# EAGLE design relay-board (EAGLE 7.5.0)
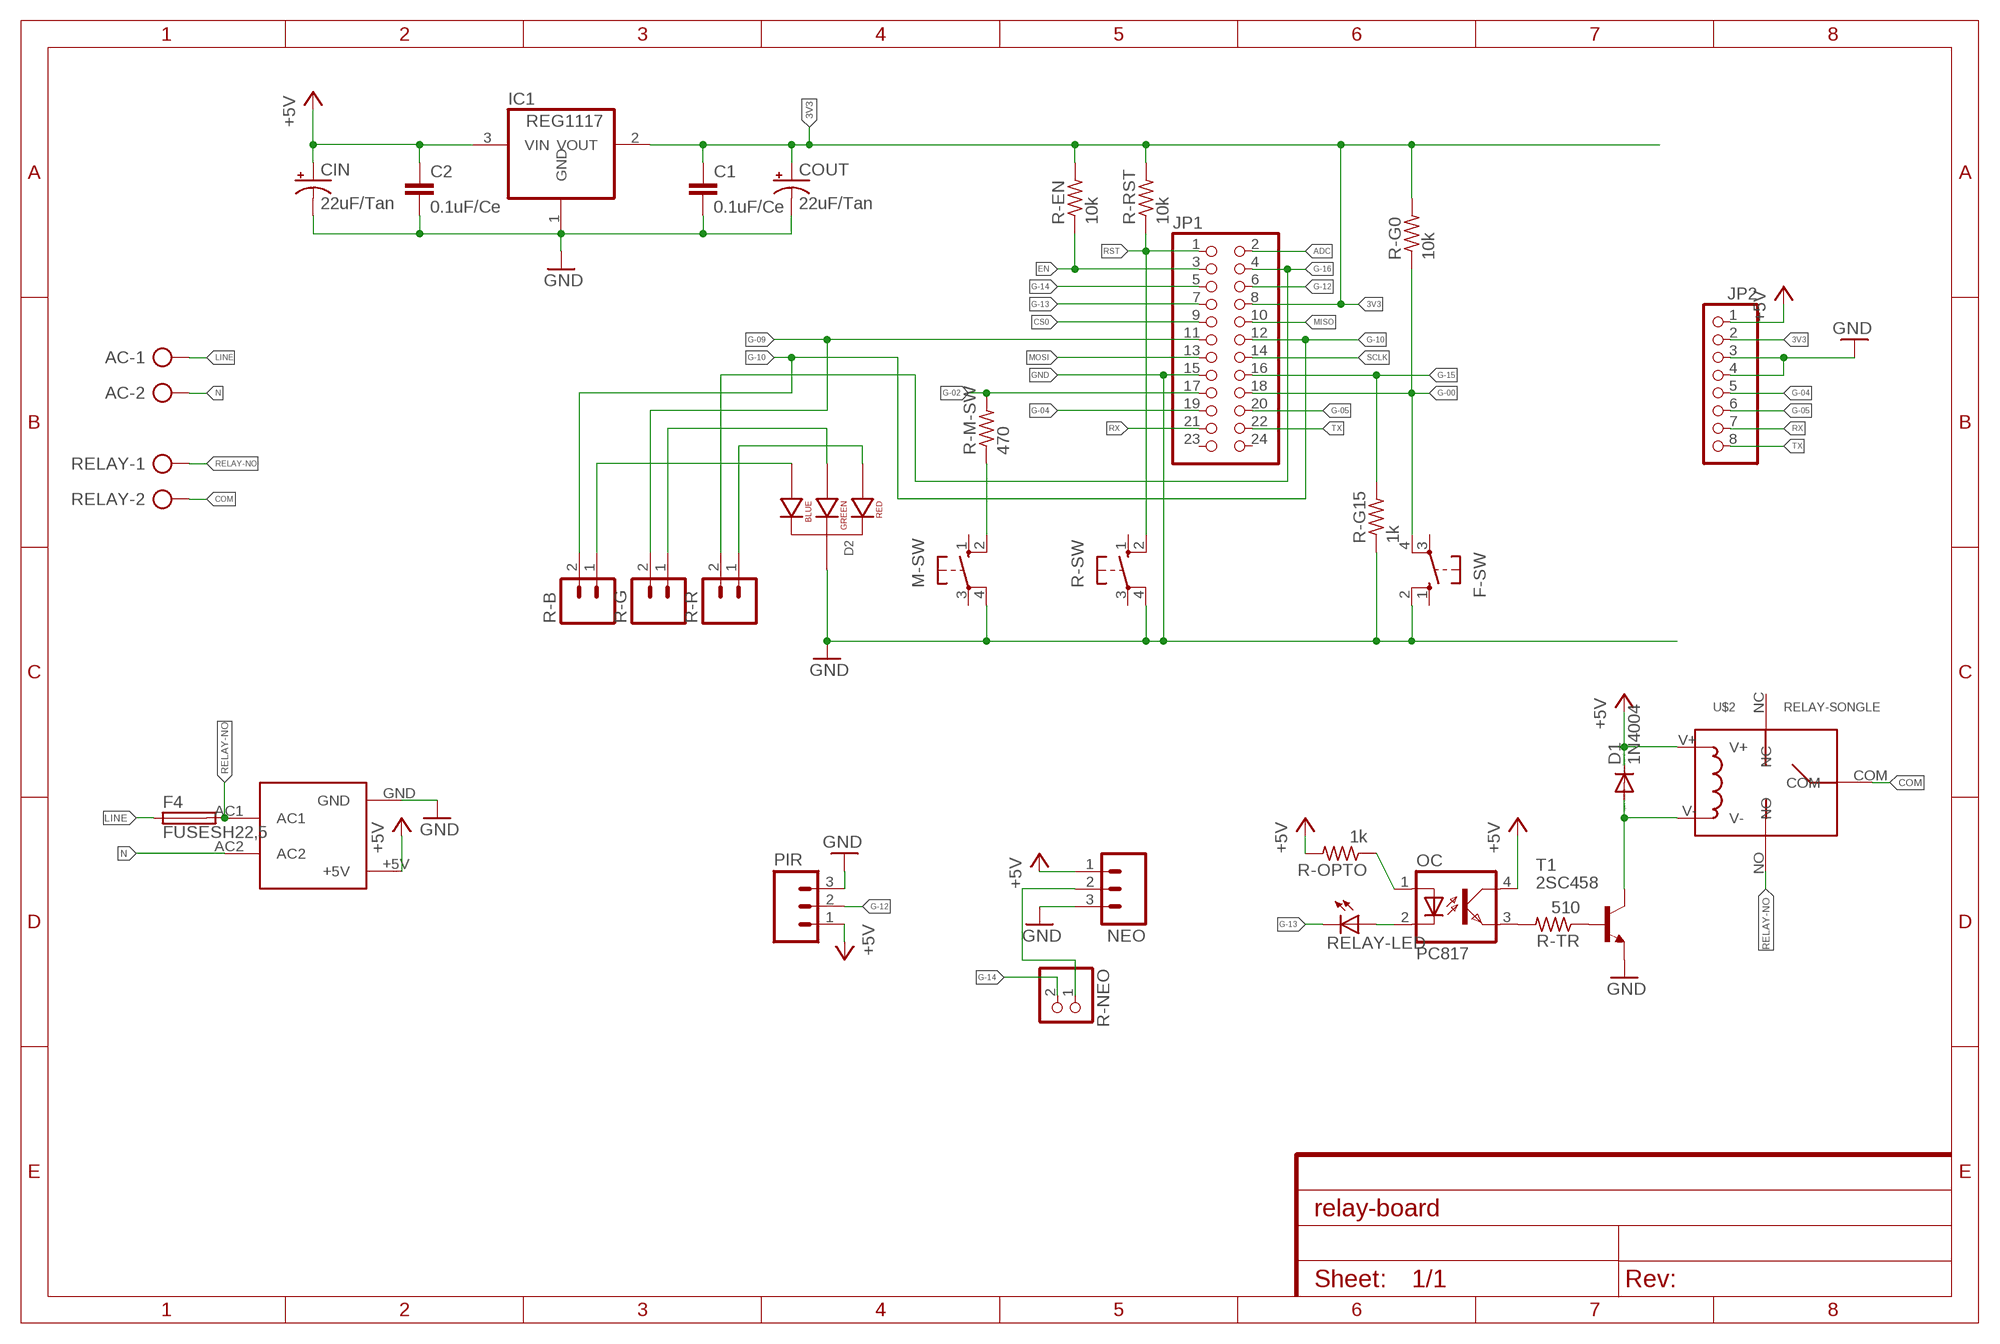
[diagram p0: schematic, sheet 1]

## Parts
AC  AK300/2  [AK300/2]
C1  0.1uF/Ce  C-EU025-024X044  [C025-024X044]
C2  0.1uF/Ce  C-EU025-024X044  [C025-024X044]
CIN  22uF/Tan  CPOL-USE2.5-5  [E2,5-5]
COUT  22uF/Tan  CPOL-USE2.5-5  [E2,5-5]
D1  1N4004  [DO41-10]
D2  LED-RGB-CC-THRU  [LED-RGB-THRU]
F4  FUSESH22,5  [SH22,5]
F-SW  10-XX  [B3F-10XX]
IC1  REG1117  [SOT223]
JP1  PINHD-2X12  [2X12]
JP2  PINHD-1X8  [1X08]
M-SW  10-XX  [B3F-10XX]
NEO  M03POLAR  [MOLEX-1X3]
OC  PC817  [DIL04]
PIR  M03POLAR  [MOLEX-1X3]
R-B  M02PTH  [1X02]
R-EN  10k  R-US_0207/7  [0207/7]
R-G  M02PTH  [1X02]
R-G0  10k  R-US_0207/7  [0207/7]
R-G15  1k  R-US_0207/7  [0207/7]
R-M-SW  470  R-US_0207/7  [0207/7]
R-NEO  PINHD-1X2  [1X02]
R-OPTO  1k  R-US_0207/7  [0207/7]
R-R  M02PTH  [1X02]
R-RST  10k  R-US_0207/7  [0207/7]
R-SW  10-XX  [B3F-10XX]
R-TR  510  R-US_0207/7  [0207/7]
RELAY  AK300/2  [AK300/2]
RELAY-LED  LED3MM  [LED3MM]
T1  2SC458  [TO92-ECB]
U$1  HLK-PM01  [HLK-PM01]
U$2  RELAY-SONGLE  [RELAY-SONGLE]

## Nets
3V3: C1.1 COUT.+ IC1.2(VOUT) JP1.8 JP2.2 R-EN.2 R-G0.2 R-RST.2
+5V: C2.1 CIN.+ D1.C IC1.3(VIN) JP2.1 NEO.1 OC.4(COL) PIR.1 R-OPTO.2 U$1.+5V U$2.V+
ADC: JP1.2
COM: RELAY.2 U$2.COM
CS0: JP1.9
EN: JP1.3 R-EN.1
G-00: F-SW.4(P1) JP1.18 R-G0.1
G-02: JP1.17 R-M-SW.2
G-04: JP1.19 JP2.5
G-05: JP1.20 JP2.6
G-09: JP1.11 R-G.2
G-10: JP1.12 R-B.2
G-12: JP1.6 PIR.2
G-13: JP1.7 RELAY-LED.K(C)
G-14: JP1.5 R-NEO.2
G-15: JP1.16 R-G15.2
G-16: JP1.4 R-R.2
GND: C1.2 C2.2 CIN.- COUT.- D2.P$2(CATHODE) F-SW.2(S1) IC1.1(GND) JP1.15 JP2.3 JP2.4 M-SW.4(P1) NEO.3 PIR.3 R-G15.1 R-SW.4(P1) T1.E U$1.GND
LINE: AC.1 F4.1
MISO: JP1.10
MOSI: JP1.13
N: AC.2 U$1.AC2
N$1: OC.3(EMIT) R-TR.2
N$2: R-TR.1 T1.B
N$3: D2.P$1(RED_CATHODE) R-R.1
N$4: D2.P$3(GREEN_CATHODE) R-G.1
N$5: D2.P$4(BLUE_CATHODE) R-B.1
N$6: OC.2(C) RELAY-LED.A
N$7: NEO.2 R-NEO.1
N$11: M-SW.2(S1) R-M-SW.1
N$13: OC.1(A) R-OPTO.1
N$18: D1.A T1.C U$2.V-
RELAY-NO: F4.2 RELAY.1 U$1.AC1 U$2.NO
RST: JP1.1 R-RST.1 R-SW.2(S1)
RX: JP1.21 JP2.7
SCLK: JP1.14
TX: JP1.22 JP2.8
Unconnected: F-SW.1(S) F-SW.3(P) JP1.23 JP1.24 M-SW.1(S) M-SW.3(P) R-SW.1(S) R-SW.3(P) U$2.NC

## Library data of the parts
AC RELAY = con-ptr500:AK300/2: CONNECTOR; OC_FARNELL: unknown; OC_NEWARK: unknown
C1 C2 = rcl:C-EU: CAPACITOR, European symbol
CIN COUT = rcl:CPOL-US: POLARIZED CAPACITOR, American symbol
D1 = diode:1N4004: DIODE general purpose rectifier, 1 A
D2 = SparkFun-LED-RGB-Tong:LED-RGB-CC-THRU: RGB Through-hole common cathode LED SparkFun Storefront: COM-00105 (Clear) COM-09264 (Diffuse)
F4 = fuse:FUSE: Fuse; OC_FARNELL: unknown; OC_NEWARK: unknown
F-SW M-SW R-SW = switch-omron:10-XX: OMRON SWITCH; MPN: B3F-1000; OC_FARNELL: 176432; OC_NEWARK: 36M3542
IC1 = burr-brown:REG1117: 800mA and 1A Low Dropout (LDO) Positive Regulator 1.8V, 2.5V, 2.85V, 3.3V, 5V, and Adj; MPN: REG1117; OC_FARNELL: 1097566; OC_NEWARK: 14P6981
JP1 = pinhead:PINHD-2X12: PIN HEADER
JP2 = pinhead:PINHD-1X8: PIN HEADER
NEO PIR = SparkFun-Connectors:M03: Header 3 Standard 3-pin 0.1" header. Use with straight break away headers (SKU : PRT-00116), right angle break away headers (PRT-00553), swiss pins (PRT-00743), machine pins (PRT-00117), and female headers (PRT-00115). Molex polarized connector foot print use with SKU : PRT-08232 with associated crimp pins and housings.
OC = optocoupler:PC817: SHARP OPTO COUPLER; MPN: PC817X4J000F; OC_FARNELL: 9707727; OC_NEWARK: 97K7059
R-B R-G R-R = SparkFun-Connectors:M02: Standard 2-pin 0.1" header. Use with - straight break away headers ( PRT-00116) - right angle break away headers (PRT-00553) - swiss pins (PRT-00743) - machine pins (PRT-00117) - female headers (PRT-00115) Molex polarized connector foot print use with: PRT-08233 with associated crimp pins and housings. 2.54_SCREWTERM for use with PRT-10571. 3.5mm Screw Terminal footprints for PRT-08084 5mm Screw Terminal footprints for use with PRT-08432
R-EN R-G0 R-G15 R-M-SW R-OPTO R-RST R-TR = rcl:R-US_: RESISTOR, American symbol
R-NEO = pinhead:PINHD-1X2: PIN HEADER
RELAY-LED = led:LED: LED OSRAM: - CHIPLED LG R971, LG N971, LY N971, LG Q971, LY Q971, LO R971, LY R971 LH N974, LH R974 LS Q976, LO Q976, LY Q976 LO Q996 - Hyper CHIPLED LW Q18S LB Q993, LB Q99A, LB R99A - SideLED LS A670, LO A670, LY A670, LG A670, LP A670 LB A673, LV A673, LT A673, LW A673 LH A674 LY A675 LS A676, LA A676, LO A676, LY A676, LW A676 LS A679, LY A679, LG A679 - Hyper Micro SIDELED® LS Y876, LA Y876, LO Y876, LY Y876 LT Y87S - SmartLED LW L88C, LW L88S LB L89C, LB L89S, LG L890 LS L89K, LO L89K, LY L89K LS L896, LA L896, LO L896, LY L896 - TOPLED LS T670, LO T670, LY T670, LG T670, LP T670 LSG T670, LSP T670, LSY T670, LOP T670, LYG T670 LG T671, LOG T671, LSG T671 LB T673, LV T673, LT T673, LW T673 LH T674 LS T676, LA T676, LO T676, LY T676, LB T676, LH T676, LSB T676, LW T676 LB T67C, LV T67C, LT T67C, LS T67K, LO T67K, LY T67K, LW E67C LS E67B, LA E67B, LO E67B, LY E67B, LB E67C, LV E67C, LT E67C LW T67C LS T679, LY T679, LG T679 LS T770, LO T770, LY T770, LG T770, LP T770 LB T773, LV T773, LT T773, LW T773 LH T774 LS E675, LA E675, LY E675, LS T675 LS T776, LA T776, LO T776, LY T776, LB T776 LHGB T686 LT T68C, LB T68C - Hyper Mini TOPLED® LB M676 - Mini TOPLED Santana® LG M470 LS M47K, LO M47K, LY M47K Source: http://www.osram.convergy.de LUXEON: - LUMILED® LXK2-PW12-R00, LXK2-PW12-S00, LXK2-PW14-U00, LXK2-PW14-V00 LXK2-PM12-R00, LXK2-PM12-S00, LXK2-PM14-U00 LXK2-PE12-Q00, LXK2-PE12-R00, LXK2-PE12-S00, LXK2-PE14-T00, LXK2-PE14-U00 LXK2-PB12-K00, LXK2-PB12-L00, LXK2-PB12-M00, LXK2-PB14-N00, LXK2-PB14-P00, LXK2-PB14-Q00 LXK2-PR12-L00, LXK2-PR12-M00, LXK2-PR14-Q00, LXK2-PR14-R00 LXK2-PD12-Q00, LXK2-PD12-R00, LXK2-PD12-S00 LXK2-PH12-R00, LXK2-PH12-S00 LXK2-PL12-P00, LXK2-PL12-Q00, LXK2-PL12-R00 Source: www.luxeon.com KINGBRIGHT: KA-3528ASYC Source: www.kingbright.com
T1 = transistor:2SC458: NPN Silicon Epitaxial Planar Transistor Source: SEMTECH ELECTRONICS LTD. ... 2SC458 1.pdf
U$1 = HLK-PM01:HLK-PM01
U$2 = Seeed-OPL-Relay:RELAY-SONGLE

## Board
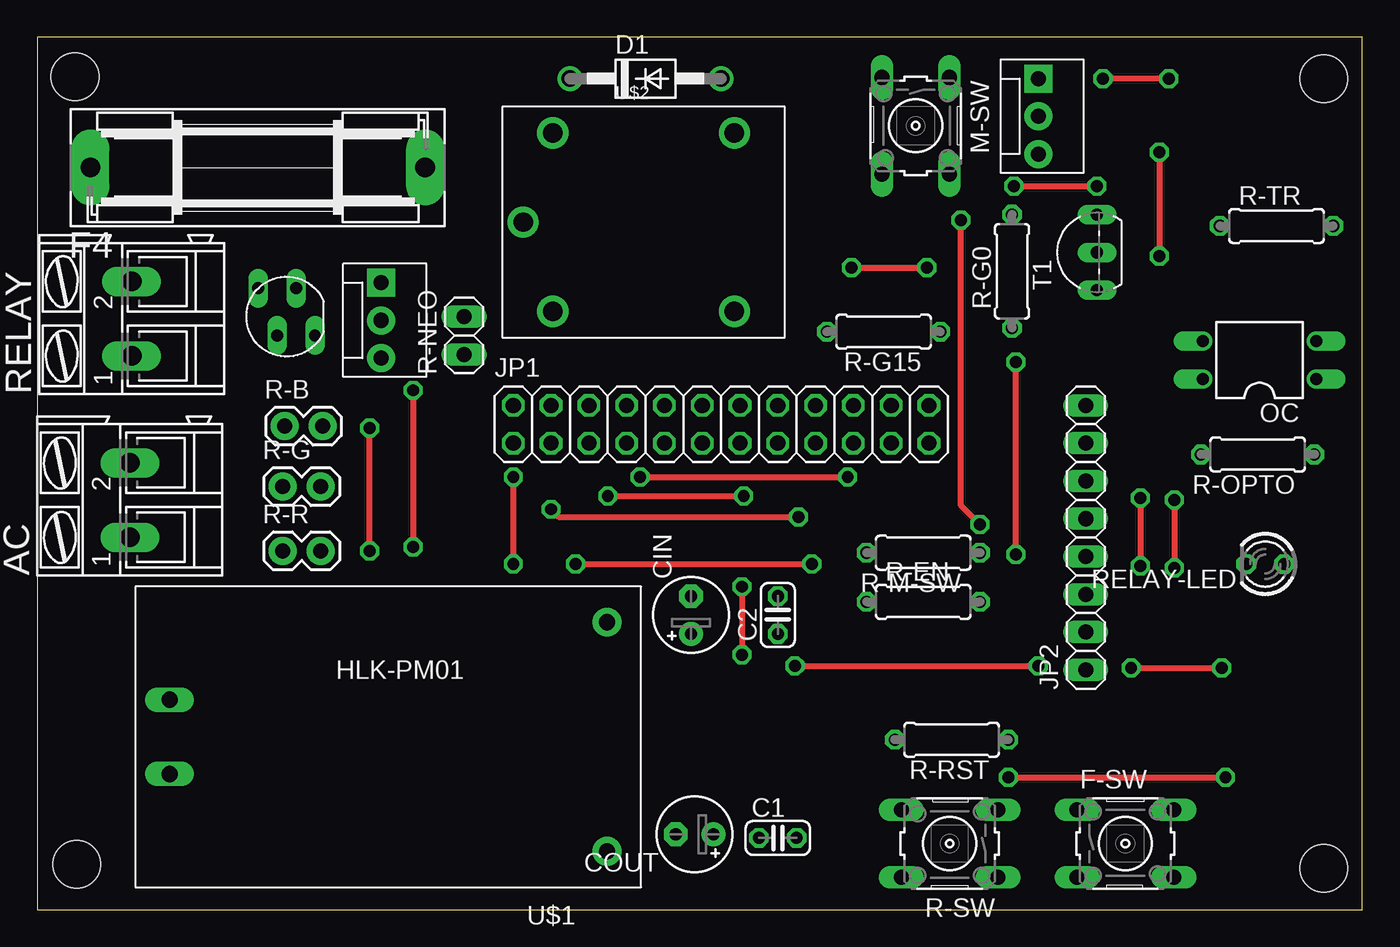
[diagram p1: board, top side]
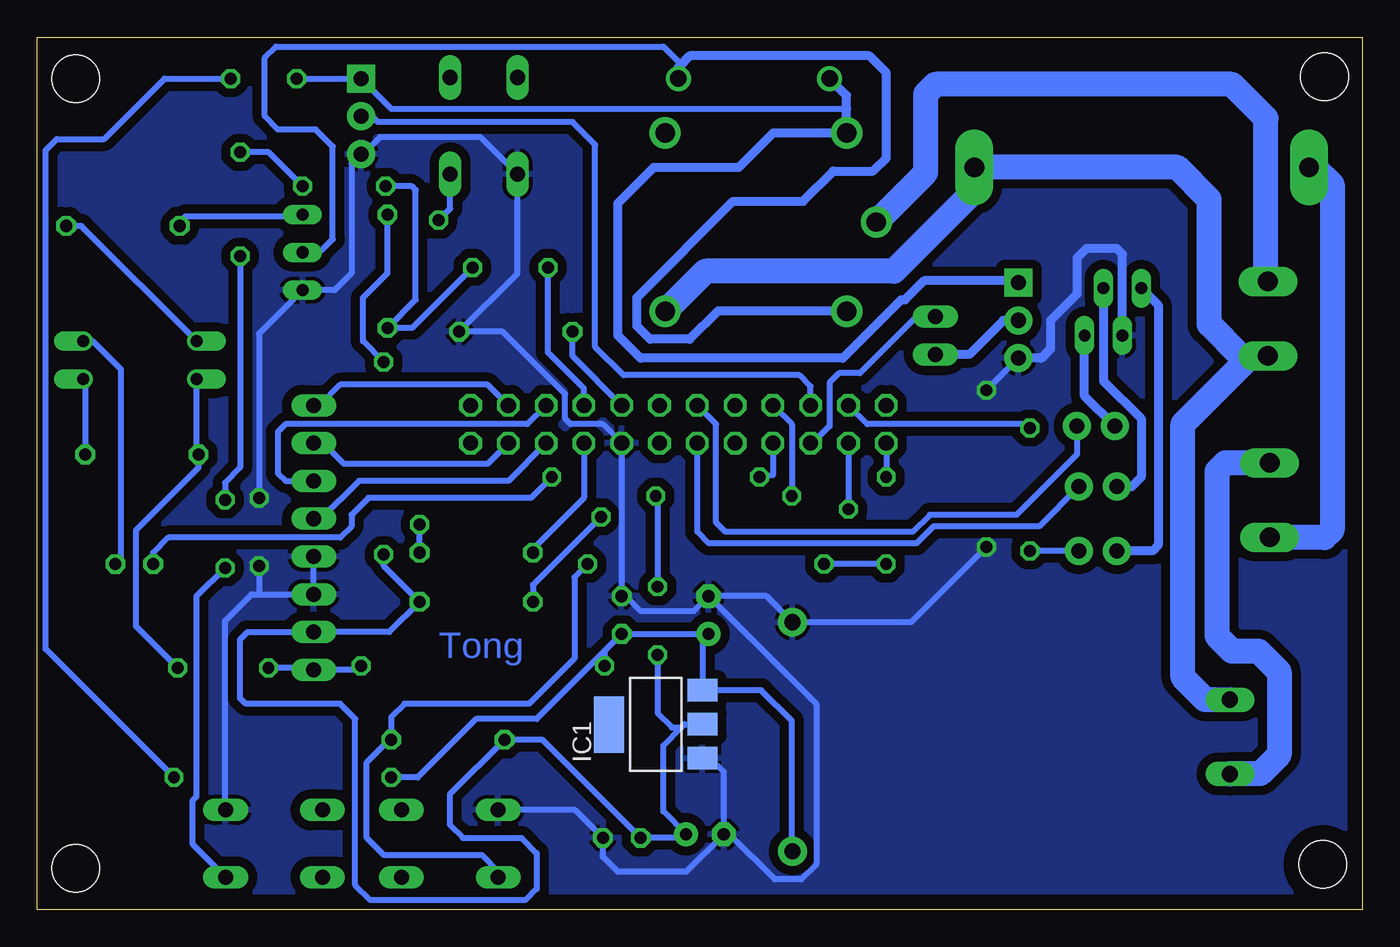
[diagram p2: board, bottom side, seen from below]

Size 89.08 x 58.66 mm. Coordinates in mm from the lower left corner, seen from the top.
Outline: 0,0 89.08,0 89.08,58.66 0,58.66 0,0
Copper layers (1*16): Top 0.035mm / dielectric 1.5mm / Bottom 0.035mm
Design rules "default": minimum track width 10mil, minimum drill 24mil, track to track 8mil, track to pad 8mil, pad to pad 8mil, via to via 8mil, smd to smd 8mil, copper to edge 40mil, drill to drill 8mil, minimum pad ring 10mil, minimum via ring 8mil, stop-mask expansion 4mil, vias tented up to drill 0mil, thermal gap 10mil
Holes 3.2 mm at 86.49,2.79 2.54,56.01 86.49,55.88 2.67,3.05

### Footprints (pad centres in the part's own frame; a part is rotated, then mirrored left to right if it is on the bottom)
AK300/2 = drill 1.321 long: 1 -2.515,0; 2 2.489,0
C025-024X044 = drill 0.813 octagon: 1 -1.27,0; 2 1.27,0
E2,5-5 = drill 0.813 pad 1.6: + -1.27,0 | drill 0.813 pad 1.6 octagon: - 1.27,0
DO41-10 = drill 1.118: A 5.08,0; C -5.08,0
LED-RGB-THRU = drill 0.8 long: P$1 -1.905,1.905; P$2 -0.635,-1.27; P$3 0.635,1.905; P$4 1.905,-1.27
SH22,5 = drill 1.321 pad 2.54 long: 1 -11.252,0; 2 11.252,0
B3F-10XX = drill 1.016 long: 1 -3.251,2.261; 2 3.251,2.261; 3 -3.251,-2.261; 4 3.251,-2.261
SOT223 = smd 1.499 x 2.007: 1 -2.261,-3.15; 2 0.025,-3.15; 3 2.311,-3.15 | smd 3.81 x 2.007: 4 0,3.15
2X12 = drill 1.016 octagon: 1 -13.97,-1.27; 2 -13.97,1.27; 3 -11.43,-1.27; 4 -11.43,1.27; 5 -8.89,-1.27; 6 -8.89,1.27; 7 -6.35,-1.27; 8 -6.35,1.27; 9 -3.81,-1.27; 10 -3.81,1.27; 11 -1.27,-1.27; 12 -1.27,1.27; 13 1.27,-1.27; 14 1.27,1.27; 15 3.81,-1.27; 16 3.81,1.27; 17 6.35,-1.27; 18 6.35,1.27; 19 8.89,-1.27; 20 8.89,1.27; 21 11.43,-1.27; 22 11.43,1.27; 23 13.97,-1.27; 24 13.97,1.27
1X08 = drill 1.016 long: 1 -8.89,0; 2 -6.35,0; 3 -3.81,0; 4 -1.27,0; 5 1.27,0; 6 3.81,0; 7 6.35,0; 8 8.89,0
MOLEX-1X3 = drill 1.016 pad 1.88 square: 1 0,0 | drill 1.016 pad 1.88: 2 2.54,0; 3 5.08,0
DIL04 = drill 0.813 offset: 1 -1.27,-3.81; 2 1.27,-3.81; 3 1.27,3.81; 4 -1.27,3.81
1X02 = drill 1.016 pad 1.88: 1 0,0; 2 2.54,0
0207/7 = drill 0.813 octagon: 1 -3.81,0; 2 3.81,0
1X02' = drill 1.016 long: 1 -1.27,0; 2 1.27,0
LED3MM = drill 0.813 octagon: A -1.27,0; K 1.27,0
TO92-ECB = drill 0.813 long: B 2.54,0; C 0,0; E -2.54,0
HLK-PM01 = drill 1.1 pad 1.93: +5V 15.19,-7.76; GND 15.19,7.64 | drill 1.1 long: AC1 -14.21,2.44; AC2 -14.21,-2.56
RELAY-SONGLE = drill 1.3 pad 2.1: COM -8.1,0; NC 6.1,6; NO 6.1,-6; V+ -6.1,6; V- -6.1,-6

### Placement (x,y rotation side)
AC  6.22,27.56 90 top
C1  49.78,4.83 0 top
C2  49.78,19.81 90 top
CIN  43.94,19.81 90 top
COUT  44.2,5.08 180 top
D1  40.89,55.88 0 top
D2  16.76,39.88 0 top
F4  14.83,49.9 0 top
F-SW  73.15,4.45 0 top
IC1  47.5,12.45 90 bottom
JP1  45.97,32.64 0 top
JP2  70.48,25.02 90 top
M-SW  59.05,52.7 270 top
NEO  23.11,42.16 270 top
OC  82.17,36.96 90 top
PIR  67.31,55.88 270 top
R-B  16.64,32.51 0 top
R-EN  59.56,20.7 0 top
R-G  16.51,28.45 0 top
R-G0  65.53,42.93 90 top
R-G15  56.9,38.86 180 top
R-M-SW  59.56,24 180 top
R-NEO  [1X02']  28.7,38.61 90 top
R-OPTO  82.04,30.61 180 top
R-R  16.51,24.13 0 top
R-RST  61.47,11.43 180 top
R-SW  61.34,4.45 180 top
R-TR  83.31,45.97 0 top
RELAY  6.35,39.75 90 top
RELAY-LED  82.55,23.24 180 top
T1  71.25,44.2 90 top
U$1  23.11,11.68 0 top
U$2  40.77,46.23 0 top

### Tracks (layer width: path | path; a pad name or v marks a point on that pad's centre or on a via)
3V3  (via drill 0.8 pad 1.27)
  Top 0.406: v38.35,27.81 v47.5,27.81 | v47.37,21.72 v47.37,17.14 | v65.79,23.88 v65.79,36.83
  Bottom 0.406: 45.78,12.26 46.99,11.05 46.99,6.6 COUT.+ 45.72,4.83 C1.1 55.12,11.43 R-RST.2 61.34,7.75 61.34,5.71 60.45,4.83 56.52,4.83 55.5,3.81 55.5,1.4 56.26,0.64 66.67,0.64 67.69,1.65 67.69,12.83 68.71,13.84 75.06,13.84 75.44,14.22 75.44,18.16 74.93,18.67 JP2.2 65.41,18.67 R-EN.2 65.79,23.11 v65.79,23.88 | 45.78,12.26 45.57,12.47 IC1.2 | JP1.8 38.35,32.64 v38.35,27.81 | v47.5,27.81 47.37,27.69 v47.37,21.72 | v47.37,17.14 47.37,13.21 46.42,12.26 45.78,12.26 | v65.79,36.83 67.18,38.23 67.18,41.15 65.53,42.8 R-G0.2
+5V  (via drill 0.8 pad 1.27)
  Top 0.406: v50.93,16.38 v67.31,16.38 | v73.53,16.26 v79.63,16.26 | v65.28,8.89 v79.88,8.89 | v76.07,55.88 v71.63,55.88
  Bottom 0.406: 34.67,53.85 65.28,53.85 PIR.1 v71.63,55.88 | 34.67,52.57 U$2.V+ | C2.1 CIN.+ 44.35,18.14 IC1.3 40.41,14.76 38.35,12.7 38.35,3.97 U$1.+5V | C2.1 50.93,17.4 v50.93,16.38 | v67.31,16.38 67.56,16.13 JP2.1 70.61,16.26 v73.53,16.26 | v79.63,16.26 82.42,19.05 82.42,25.53 78.23,29.72 R-OPTO.2 78.36,30.73 OC.4 | C2.1 55.5,12.83 59.56,12.83 63.5,8.89 v65.28,8.89 | v79.88,8.89 88.52,17.53 88.52,51.05 87.76,51.82 84.58,51.82 80.52,55.88 v76.07,55.88
  Bottom 0.61: NEO.1 23.24,42.29 29.46,42.29 30.73,41.02 30.99,41.02 34.92,37.08 48.51,37.08 50.04,38.61 50.04,47.5 47.62,49.91 41.91,49.91 39.59,52.23 U$2.V+ 34.67,53.85 34.67,54.73 D1.C
COM
  Bottom 1.676: RELAY.2 6.48,42.37 6.48,53.21 8.76,55.5 28.7,55.5 29.34,54.86 29.34,49.56 U$2.COM
EN  (via drill 0.8 pad 1.27)
  Top 0.406: v34.54,26.92 35.05,26.42 v51.18,26.42
  Bottom 0.406: JP1.3 v34.54,26.92 | v51.18,26.42 55.75,21.84 R-EN.1
G-00  (via drill 0.8 pad 1.27)
  Top 0.406: v54.74,43.18 v59.82,43.18 | v65.66,48.64 v71.25,48.64 | v75.44,50.93 v75.44,43.94 | v76.45,27.56 v76.45,22.99
  Bottom 0.406: JP1.18 52.32,35.05 54.74,37.47 v54.74,43.18 | F-SW.4 78.61,4.39 78.61,7.37 78.36,7.62 78.36,21.08 v76.45,22.99 | v59.82,43.18 63.88,39.12 R-G0.1 63.63,41.02 63.63,48.39 63.88,48.64 v65.66,48.64 | v71.25,48.64 73.53,50.93 v75.44,50.93 | v75.44,43.94 75.44,29.72 76.45,28.7 v76.45,27.56
G-02
  Bottom 0.406: JP1.17 52.32,27.69 55.75,24.26 R-M-SW.2
G-04
  Bottom 0.406: JP1.19 57.4,28.83 67.44,28.83 69.98,26.29 JP2.5
G-05
  Bottom 0.406: JP1.20 56.13,32.64 72.39,32.64 72.9,32.13 72.9,29.34 72.39,28.83 JP2.6
G-09
  Bottom 0.406: R-G.2 21.72,25.78 28.83,25.78 29.97,24.64 43.94,24.64 44.7,25.4 JP1.11
G-10
  Bottom 0.406: JP1.12 43.43,32.64 43.43,26.04 42.8,25.4 30.23,25.4 29.08,26.54 23.24,26.54 19.18,30.61 R-B.2
G-12
  Bottom 0.406: JP1.6 37.08,35.18 37.85,35.94 49.66,35.94 51.56,37.85 51.56,51.44 53.09,52.96 66.17,52.96 66.55,53.34 PIR.2
G-13  (via drill 0.8 pad 1.27)
  Top 0.406: v40.51,29.08 v54.48,29.08
  Bottom 0.406: JP1.7 39.62,29.21 v40.51,29.08 | RELAY-LED.K 81.28,24 80.26,25.02 68.71,25.02 67.94,25.78 67.94,26.54 66.8,27.69 55.88,27.69 v54.48,29.08
G-14
  Bottom 0.406: R-NEO.2 29.97,39.88 33.78,36.07 35.18,36.07 35.81,35.43 35.81,32.51 36.96,31.37 JP1.5
G-15
  Bottom 0.406: JP1.16 53.09,37.21 R-G15.2
G-16  (via drill 0.8 pad 1.27)
  Top 0.406: v22.35,24.13 v22.35,32.38
  Bottom 0.406: R-R.2 v22.35,24.13 | v22.35,32.38 22.61,32.64 33.27,32.64 JP1.4
GND  (via drill 0.8 pad 1.27)
  Top 0.406: v25.27,34.92 v25.27,24.38 | v74.17,27.69 v74.17,23.11
  Bottom 0.406: NEO.3 v25.27,34.92 | v25.27,24.38 30.33,19.32 U$1.GND 40.06,21.08 CIN.- | CIN.- 36.7,13.84 36.7,3.05 37.72,2.03 39.5,2.03 42.55,5.08 COUT.- | COUT.- 42.93,9.27 43.84,10.19 IC1.1 | COUT.- 45.47,2.54 50.04,2.54 51.05,3.56 C1.2 52.93,6.71 R-SW.4 | F-SW.2 76.45,6.76 76.45,19.43 74.68,21.21 74.17,21.21 | 74.17,21.21 JP2.3 JP2.4 | CIN.- 44.96,20.07 48.51,20.07 49.53,21.08 C2.2 JP1.15 51.05,32.64 53.21,32.64 53.59,33.02 53.59,34.67 57.78,38.86 R-G15.1 56.79,42.77 M-SW.4 59.28,51.94 66.04,51.94 67.18,50.8 PIR.3 67.94,50.16 67.94,42.8 69.09,41.66 T1.E 74.17,38.73 v74.17,27.69 | v74.17,23.11 74.17,21.21
  Bottom 0.61: D2.P$2 16.13,44.07 16.51,44.45 18.54,44.45 19.18,43.81 19.18,41.4 20.95,39.62 20.95,37.72 21.59,37.08 NEO.3
  pour Bottom (isolate 0.61): 0,0 89.03,0 89.03,58.67 0,58.67
LINE
  Bottom 1.676: F4.1 3.17,49.9 2.03,48.77 2.03,25.53 2.54,25.02 6.2,25.02 AC.1
N
  Bottom 1.676: AC.2 9.2,30.05 9.78,29.46 9.78,18.41 8.76,17.4 6.99,17.4 5.59,16 5.59,10.41 6.86,9.14 8.88,9.14 U$1.AC2
N$1
  Bottom 0.406: OC.3 86.11,45.97 R-TR.2
N$2
  Bottom 0.406: T1.B 71.37,46.61 79.12,46.61 79.5,46.23 R-TR.1
N$3
  Bottom 0.61: D2.P$1 13.72,40.64 13.72,24.51 14.1,24.13 R-R.1
N$4
  Bottom 0.61: D2.P$3 17.4,35.56 14.86,33.02 14.86,29.08 15.49,28.45 R-G.1
N$5
  Bottom 0.61: R-B.1 18.67,34.54 D2.P$4
N$6
  Bottom 0.406: RELAY-LED.A 83.44,23.62 83.44,36.32 85.34,38.23 OC.2
N$7
  Bottom 0.61: NEO.2 24.13,39.62 26.42,37.34 R-NEO.1
N$11  (via drill 0.8 pad 1.27)
  Top 0.406: v63.37,25.91 62.1,27.18 v62.1,46.35
  Bottom 0.406: R-M-SW.1 v63.37,25.91 | v62.1,46.35 61.32,47.14 M-SW.2
N$13
  Bottom 0.406: OC.1 85.85,35.56 R-OPTO.1
N$18
  Bottom 0.406: T1.C 71.12,44.32 69.98,44.32 69.22,45.09 69.22,51.31 70.36,52.45 72.9,52.45 73.79,53.34 73.79,57.28 73.03,58.04 46.99,58.04 45.97,57.02 45.97,56.64
  Bottom 0.61: U$2.V- 34.7,40.26 43.31,40.26 45.21,38.35 47.88,38.35 48.77,39.24 48.77,41.15 42.29,47.62 37.59,47.62 35.56,49.66 32.89,49.66 32,50.55 32,56.26 33.15,57.4 45.21,57.4 45.97,56.64 D1.A
RELAY-NO
  Bottom 1.676: U$2.NO 44.17,42.93 31.5,42.93 26.08,48.34 F4.2 26.07,49.91 12.45,49.91 10.29,47.75 10.29,39.37 8.15,37.24 7.49,37.24 | RELAY.1 7.49,37.24 | U$1.AC1 10.57,14.12 12.06,15.62 12.06,32.66 7.49,37.24
RST  (via drill 0.8 pad 1.27)
  Top 0.406: v32,29.08 v32,23.24 | v36.2,23.24 v52.07,23.24
  Bottom 0.406: JP1.1 v32,29.08 | v32,23.24 v36.2,23.24 | v52.07,23.24 52.96,22.35 52.96,16.89 56.01,13.84 64.39,13.84 65.28,12.95 R-RST.1 65.41,11.43 66.93,9.91 66.93,4.83 65.79,3.68 59.18,3.68 58.09,2.59 R-SW.2
RX
  Bottom 0.406: JP1.21 58.8,29.97 68.45,29.97 69.85,31.37 JP2.7
TX
  Bottom 0.406: JP1.22 58.8,35.31 68.71,35.31 70.1,33.91 JP2.8

### Text on the board
Bottom: Tong